# Altium schematic sheet SWEEP.SchDoc
size Tabloid; SheetNumber: 4; SheetTotal: 9
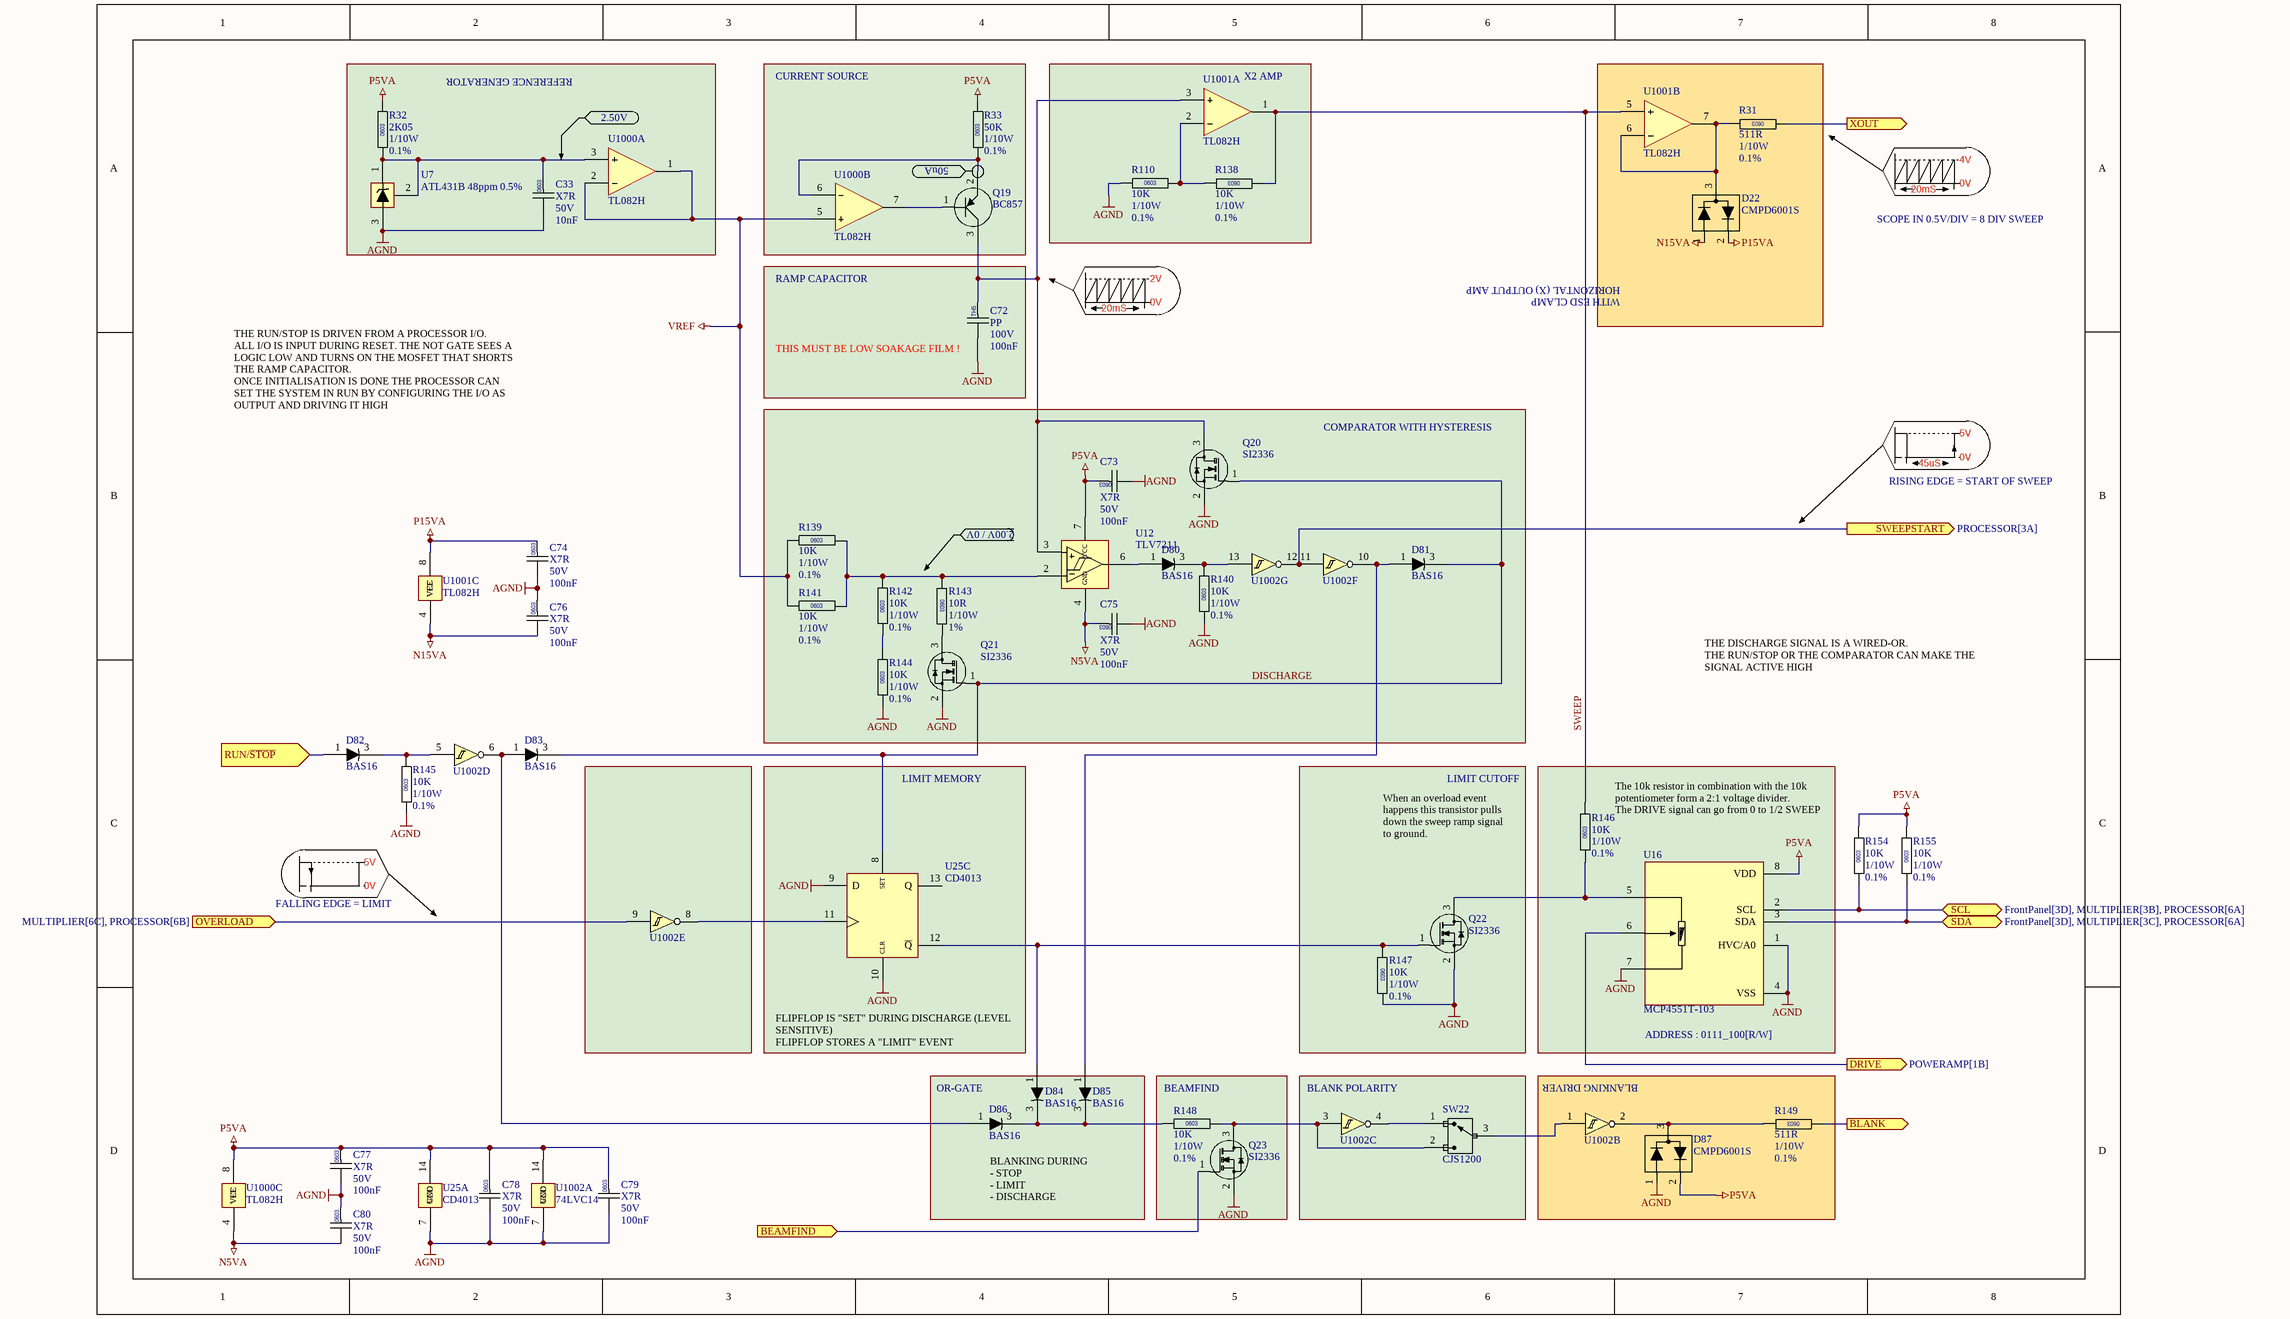
[diagram p0: SWEEP.SchDoc]

## Parts
C33  Dielectric: X7R  Voltage: 50V  Capacitance: 10nF  [CAPC0603]  (hidden comment: CAP0603)
C72  Dielectric: PP  Voltage: 100V  Capacitance: 100nF  [CAPF50P720X720]  (hidden comment: CAPF)
C73  Dielectric: X7R  Voltage: 50V  Capacitance: 100nF  [CAPC0603]  (hidden comment: CAP0603)
C74  Dielectric: X7R  Voltage: 50V  Capacitance: 100nF  [CAPC0603]  (hidden comment: CAP0603)
C75  Dielectric: X7R  Voltage: 50V  Capacitance: 100nF  [CAPC0603]  (hidden comment: CAP0603)
C76  Dielectric: X7R  Voltage: 50V  Capacitance: 100nF  [CAPC0603]  (hidden comment: CAP0603)
C77  Dielectric: X7R  Voltage: 50V  Capacitance: 100nF  [CAPC0603]  (hidden comment: CAP0603)
C78  Dielectric: X7R  Voltage: 50V  Capacitance: 100nF  [CAPC0603]  (hidden comment: CAP0603)
C79  Dielectric: X7R  Voltage: 50V  Capacitance: 100nF  [CAPC0603]  (hidden comment: CAP0603)
C80  Dielectric: X7R  Voltage: 50V  Capacitance: 100nF  [CAPC0603]  (hidden comment: CAP0603)
D22  CMPD6001S  [SOT23]
D80  BAS16  [SOT23]
D81  BAS16  [SOT23]
D82  BAS16  [SOT23]
D83  BAS16  [SOT23]
D84  BAS16  [SOT23]
D85  BAS16  [SOT23]
D86  BAS16  [SOT23]
D87  CMPD6001S  [SOT23]
Q19  BC857  [SOT23]
Q20  SI2336  [SOT23]
Q21  SI2336  [SOT23]
Q22  SI2336  [SOT23]
Q23  SI2336  [SOT23]
R31  value 511R  Power: 1/10W  Tolerance: 0.1%  [RESC0603]  (hidden comment: RESC0603)
R32  value 2K05  Power: 1/10W  Tolerance: 0.1%  [RESC0603]  (hidden comment: RESC0603)
R33  value 50K  Power: 1/10W  Tolerance: 0.1%  [RESC0603]  (hidden comment: RESC0603)
R110  value 10K  Power: 1/10W  Tolerance: 0.1%  [RESC0603]  (hidden comment: RESC0603)
R138  value 10K  Power: 1/10W  Tolerance: 0.1%  [RESC0603]  (hidden comment: RESC0603)
R139  value 10K  Power: 1/10W  Tolerance: 0.1%  [RESC0603]  (hidden comment: RESC0603)
R140  value 10K  Power: 1/10W  Tolerance: 0.1%  [RESC0603]  (hidden comment: RESC0603)
R141  value 10K  Power: 1/10W  Tolerance: 0.1%  [RESC0603]  (hidden comment: RESC0603)
R142  value 10K  Power: 1/10W  Tolerance: 0.1%  [RESC0603]  (hidden comment: RESC0603)
R143  value 10R  Power: 1/10W  Tolerance: 1%  [RESC0603]  (hidden comment: RESC0603)
R144  value 10K  Power: 1/10W  Tolerance: 0.1%  [RESC0603]  (hidden comment: RESC0603)
R145  value 10K  Power: 1/10W  Tolerance: 0.1%  [RESC0603]  (hidden comment: RESC0603)
R146  value 10K  Power: 1/10W  Tolerance: 0.1%  [RESC0603]  (hidden comment: RESC0603)
R147  value 10K  Power: 1/10W  Tolerance: 0.1%  [RESC0603]  (hidden comment: RESC0603)
R148  value 10K  Power: 1/10W  Tolerance: 0.1%  [RESC0603]  (hidden comment: RESC0603)
R149  value 511R  Power: 1/10W  Tolerance: 0.1%  [RESC0603]  (hidden comment: RESC0603)
R154  value 10K  Power: 1/10W  Tolerance: 0.1%  [RESC0603]  (hidden comment: RESC0603)
R155  value 10K  Power: 1/10W  Tolerance: 0.1%  [RESC0603]  (hidden comment: RESC0603)
SW22  CJS1200  [SWITCH-NIDEC-CJS-1200TB1]
U7  ATL431B 48ppm 0.5%  [SOT23]
U12  TLV7211  [SO127P600-8N]
U16  MCP4551T-103  [SO65P490-8N]
U25  CD4013  [SO127P600-14N]  (parts A,C of 3)
U1000  TL082H  [SO127P600-8N]  (parts A,B,C of 3)
U1001  TL082H  [SO127P600-8N]  (parts A,B,C of 3)
U1002  74LVC14  [SO127P600-14N]  (parts A,B,C,D,E,F,G of 7)

## Blocks framed on the sheet
X2 AMP: R110 R138 U1001
LIMIT MEMORY: U25
LIMIT CUTOFF: Q22 R147
ADDRESS : 0111_100[R/W]: R146 U16
OR-GATE: D84-D86
BEAMFIND: Q23 R148
BLANK POLARITY: SW22 U1002
BLANKING DRIVER: D87 R149 U1002

## Ports
BEAMFIND (in), BLANK (out), DRIVE (out, see POWERAMP[1B]), OVERLOAD (in, see MULTIPLIER[6C], PROCESSOR[6B]), RUN/~{STOP} (in), SCL (bidir, see FrontPanel[3D], MULTIPLIER[3B], PROCESSOR[6A]), SDA (bidir, see FrontPanel[3D], MULTIPLIER[3C], PROCESSOR[6A]), SWEEPSTART (out, see PROCESSOR[3A]), XOUT (out)

## Nets
AGND: C33.2 C72.2 C73.2 C74.2 C75.2 C76.1 C77.2 C78.2 C79.2 C80.1 D87.1(K) Q20.2(S) Q21.2(S) Q22.2(S) Q23.2(S) R110.2 R140.2 R144.2 R145.2 R147.1 U7.3 U16.1(HVC/A0) U16.4(VSS) U16.7(POB) U25.7(GND) U25.9(D) U25.10(CLR) U1002.7(GND)
N5VA: C75.1 C80.2 U12.4(GND) U1000.4(VEE)
N15VA: C76.2 D22.1(K) U1001.4(VEE)
P5VA: C73.1 C77.1 C78.1 C79.1 D87.2(A) R32.1 R33.1 R154.1 R155.1 U12.7(VCC) U16.8(VDD) U25.14(VCC) U1000.8(VCC) U1002.14(VCC)
P15VA: C74.1 D22.2(A) U1001.8(VCC)
VREF: R139.2 R141.2 U1000.1(O) U1000.2(-) U1000.5(+)
BEAMFIND: Q23.1(G1) ; port BEAMFIND
BLANK: R149.2 ; port BLANK
DISCHARGE: D81.3(K) D83.3(K) Q20.1(G1) Q21.1(G1) U25.8(SET)
DRIVE: U16.6(OW) ; port DRIVE
OVERLOAD: U1002.9 ; port OVERLOAD
RUN/~{STOP}: D82.1(A) ; port RUN/~{STOP}
SCL: R154.2 U16.2(SCL) ; port SCL
SDA: R155.2 U16.3(SDA) ; port SDA
SWEEP: R138.2 R146.1 U1001.1(O) U1001.5(+)
SWEEPSTART: U1002.11 U1002.12 ; port SWEEPSTART
XOUT: R31.2 ; port XOUT
NetC33_1: C33.1 R32.2 U7.1 U7.2 U1000.3(+)
NetC72_1: C72.1 Q19.3(C) Q20.3(D) U12.3(+) U1001.3(+)
NetD22_3: D22.3(A) R31.1 U1001.6(-) U1001.7(O)
NetD80_1: D80.1(A) U12.6(OUT)
NetD80_3: D80.3(K) R140.1 U1002.13
NetD81_1: D81.1(A) D85.1(A) U1002.10
NetD82_3: D82.3(K) R145.1 U1002.5
NetD83_1: D83.1(A) D86.1(A) U1002.6
NetD84_1: D84.1(A) Q22.1(G1) R147.2 U25.12(~{Q})
NetD84_3: D84.3(K) D85.3(K) D86.3(K) R148.2
NetD87_3: D87.3(A) R149.1 U1002.2
NetQ19_1: Q19.1(B) U1000.7(O)
NetQ19_2: Q19.2(E) R33.2 U1000.6(-)
NetQ21_3: Q21.3(D) R143.1
NetQ22_3: Q22.3(D) R146.2 U16.5(POA)
NetQ23_3: Q23.3(D) R148.1 SW22.2 U1002.3
NetR110_1: R110.1 R138.1 U1001.2(-)
NetR139_1: R139.1 R141.1 R142.1 R143.2 U12.2(-)
NetR142_2: R142.2 R144.1
NetSW22_1: SW22.1 U1002.4
NetSW22_3: SW22.3 U1002.1
NetU25_11: U25.11(CLK) U1002.8

Not connected (* = marked no-connect by the designer): U25 13(Q)

## Notes on the sheet
- REFERENCE GENERATOR
- CURRENT SOURCE
- (near U1000) 2.50V
- (near Q19) 50uA
- 20mS
- 4V
- 0V
- SCOPE IN 0.5V/DIV = 8 DIV SWEEP
- RAMP CAPACITOR
- 2V
- HORIZONTAL (X) OUTPUT AMP
- WITH ESD CLAMP
- (near C72) THIS MUST BE LOW SOAKAGE FILM !
- THE RUN/STOP IS DRIVEN FROM A PROCESSOR I/O.
  ALL I/O IS INPUT DURING RESET. THE NOT GATE SEES A LOGIC LOW AND TURNS ON THE MOSFET THAT SHORTS THE RAMP CAPACITOR.
  ONCE INITIALISATION IS DONE THE PROCESSOR CAN SET THE SYSTEM IN RUN BY CONFIGURING THE I/O AS OUTPUT AND DRIVING IT HIGH
- COMPARATOR WITH HYSTERESIS
- 5V
- RISING EDGE = START OF SWEEP
- 45uS
- 2.00V / 0V
- THE DISCHARGE SIGNAL IS A WIRED-OR.
  THE RUN/STOP OR THE COMPARATOR CAN MAKE THE SIGNAL ACTIVE HIGH
- (near U16) The 10k resistor in combination with the 10k potentiometer form a 2:1 voltage divider.
  The DRIVE signal can go from 0 to 1/2 SWEEP
- FALLING EDGE = LIMIT
- When an overload event happens this transistor pulls down the sweep ramp signal to ground.
- FLIPFLOP IS "SET" DURING DISCHARGE (LEVEL SENSITIVE)
  FLIPFLOP STORES A "LIMIT" EVENT
- (near D86) BLANKING DURING
  - STOP
  - LIMIT
  - DISCHARGE
- (in symbol CAPF-100nF-100V) TH5
- (in symbol RESC-0603-2K05-0.1%-1/10W) 0603
- (in symbol RESC-0603-10K-0.1%-1/10W) 0603
- (in symbol RESC-0603-10R-1%-1/10W) 0603
- (in symbol RESC-0603-50K-0.1%-1/10W) 0603
- (in symbol RESC-0603-511R-0.1%) 0603

## Library data of the parts
C33 = CAPC-0603-10nF-50V-X7R: CAPACITOR,CERAMIC,10nF,50V,X7R,0603; Package / Case: 0603; Location: *
C72 = CAPF-100nF-100V: CAPACITOR,POLYPROP,100nF,100V; Manufacturer 1: KEMET; Manufacturer Part Number 1: PHE426DJ6100JR05; Package / Case: CAPF50P720X720; Location: *; DIGIKEY: 399-11462-ND
C73-C80 = CAPC-0603-100nF-50V-X7R: CAPACITOR,CERAMIC,100nF,50V,X7R,0603; Manufacturer 1: KEMET; Manufacturer Part Number 1: C0603C104K5RACTU; Package / Case: 0603; Location: *; Supplier 1: Mouser; Supplier Part Number 1: 80-C0603C104K5R7867; Supplier 2: Mouser; Supplier Part Number 2: 80-C0603C104K5R7411; Supplier 3: Avnet; Supplier Part Number 3: KGM15BR71H104KT; Supplier 4: Digikey; Supplier Part Number 4: 1276-1000-1-ND; LCSC: C127833; MOUSER: 80-C0603C104K5R
D22 D87 = DIODE-CENTRALSEMI-CMPD6001S: DIODE,75V,250mA,SOT23,500pA ULTRA LOW LEAKAGE; Manufacturer 1: CENTRAL SEMICONDUCTOR; DIGIKEY: 1514-CMPD6001STRPBFREECT-ND; Manufacturer Part Number 1: CMPD6001S
D80-D86 = DIODE-RECTIFIER-DIODES-BAS16-SOT23: DIODE,RECTIFIER,75V,0.3A,BAS16,SOT23; Manufacturer 1: ONSEMI; Manufacturer Part Number 1: BAS16LT1G; DIGIKEY: BAS16LT1GOSCT-ND
Q19 = XSTR-PNP-BC857: XSTR,PNP,SOT23,BC857,SOT23; Manufacturer 1: NEXPERIA; Manufacturer Part Number 1: BC857BW,115; DIGIKEY: 1727-4869-1-ND
Q20-Q23 = XSTR-NMOS-VISHAY-SI2336DS-T1-BE3: XSTR,NMOS,30V,4.3A,SI2336DS-T1-BE3.SOT23; Manufacturer 1: VISHAY; Package: SOT23; Vds: 30V; Idmax: 4.3A; DIGIKEY: 742-SI2336DS-T1-BE3CT-ND; Manufacturer Part Number 1: SI2336DS-T1-BE3
R31 R149 = RESC-0603-511R-0.1%: RESISTOR,511R,0.1%,100mW,0603 (1608); Location: *
R32 = RESC-0603-2K05-0.1%-1/10W: RESISTOR,2K05,0.11%,100mW,0603 (1608); Location: *
R33 = RESC-0603-50K-0.1%-1/10W: RESISTOR,50K,0.1%,100mW,0603 (1608); Location: *
R110 R138-R142 R144-R148 R154 R155 = RESC-0603-10K-0.1%-1/10W: RESISTOR,10K,0.1%,100mW,0603 (1608); Manufacturer 1: PANASONIC; Manufacturer Part Number 1: ERA-3AEB103V; Location: *; DIGIKEY: P10KDBCT-ND
R143 = RESC-0603-10R-1%-1/10W: RESISTOR,10R,1%,100mW,0603 (1608); Location: *
SW22 = SWITCH-NIDEC-CJS-1200TB1: SWITCH,SPST,SLIDE,SMD; Manufacturer 1: NIDEC; DIGIKEY: 563-CJS-1200TB1CT-ND; Manufacturer Part Number 1: CJS-1200TB1
U7 = IC-TI-ATL431B-SOT23: IC,REGULATOR,REFERENCE,SHUNT,0.5%,48ppm,TL431,SOT23; Manufacturer 1: TI; Manufacturer Part Number 1: ATL431BIDBZR; DIGIKEY: 296-47739-1-ND
U12 = IC-TI-TLV7211-SO8: IC,COMPARATOR,SINGLE,PUSHPULL,TI,TLV7211,SO8; Manufacturer Part Number 1: TLV7211IDR; DIGIKEY: 296-21871-1-ND; Manufacturer 1: TI
U16 = IC-MICROCHIP-MCP4551T-103: IC,DIGITAL POTMETER,257STEP,I2C,10K,MICROCHIP,MCP4551T-103; Manufacturer Part Number 1: MCP4551T-103E/MS; DIGIKEY: MCP4551T-103E/MSCT-ND; Manufacturer 1: MICROCHIP
U25 = IC-TI-CD4013-SO14: IC,LOGIC,CMOS,4XXX,DUAL D-FLIPFLOP,CD4013; Manufacturer 1: TI; Manufacturer Part Number 1: CD4013BM96; DIGIKEY: 296-24347-1-ND
U1000 U1001 = IC-TI-TL082H-SO8: IC,OPAMP JFET,DUAL,TL082HIDR,SO8; Manufacturer 1: TI; Manufacturer Part Number 1: TL082HIDR; MOUSER: 595-TL082HIDR
U1002 = IC-DIODES-74LVC14AS14-13-SO14: IC,LOGIC,CMOS,74XX,HEX SCHMITTTRIGGER,74LVC14AS14-13,SO14; Manufacturer 1: DIODES; DIGIKEY: 74LVC14AS14-13DICT-ND; Manufacturer Part Number 1: 74LVC14AS14-13